# EAGLE design Protoboard MX2-7-6 (EAGLE 7.6.0)
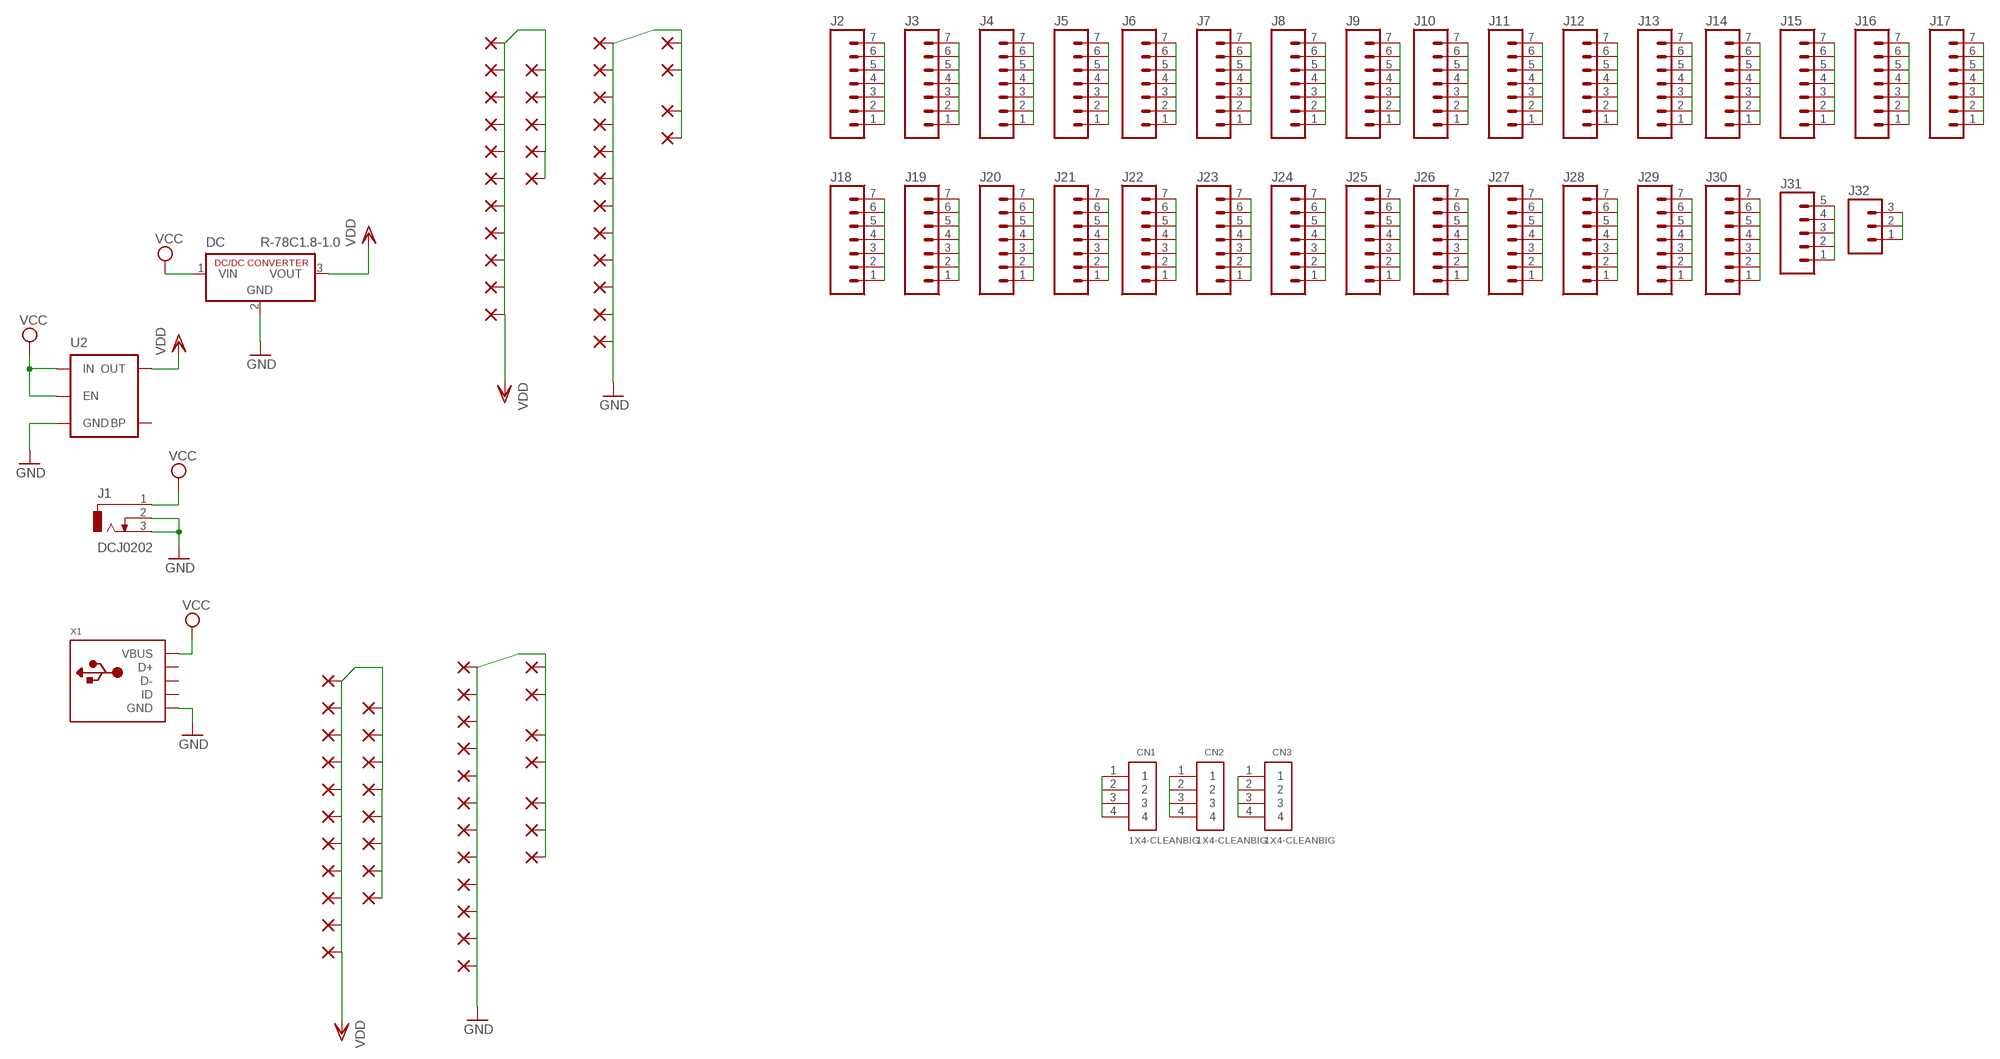
[diagram p0: schematic, sheet 1]

## Parts
CN1  1X4-CLEANBIG  [1X04-CLEANBIG]
CN2  1X4-CLEANBIG  [1X04-CLEANBIG]
CN3  1X4-CLEANBIG  [1X04-CLEANBIG]
DC  R-78C1.8-1.0  [SIP3]
J1  DCJ0202  [DCJ0202]
J2  M07NO_SILK  [1X07_NO_SILK]
J3  M07NO_SILK  [1X07_NO_SILK]
J4  M07NO_SILK  [1X07_NO_SILK]
J5  M07NO_SILK  [1X07_NO_SILK]
J6  M07NO_SILK  [1X07_NO_SILK]
J7  M07NO_SILK  [1X07_NO_SILK]
J8  M07NO_SILK  [1X07_NO_SILK]
J9  M07NO_SILK  [1X07_NO_SILK]
J10  M07NO_SILK  [1X07_NO_SILK]
J11  M07NO_SILK  [1X07_NO_SILK]
J12  M07NO_SILK  [1X07_NO_SILK]
J13  M07NO_SILK  [1X07_NO_SILK]
J14  M07NO_SILK  [1X07_NO_SILK]
J15  M07NO_SILK  [1X07_NO_SILK]
J16  M07NO_SILK  [1X07_NO_SILK]
J17  M07NO_SILK  [1X07_NO_SILK]
J18  M07NO_SILK  [1X07_NO_SILK]
J19  M07NO_SILK  [1X07_NO_SILK]
J20  M07NO_SILK  [1X07_NO_SILK]
J21  M07NO_SILK  [1X07_NO_SILK]
J22  M07NO_SILK  [1X07_NO_SILK]
J23  M07NO_SILK  [1X07_NO_SILK]
J24  M07NO_SILK  [1X07_NO_SILK]
J25  M07NO_SILK  [1X07_NO_SILK]
J26  M07NO_SILK  [1X07_NO_SILK]
J27  M07NO_SILK  [1X07_NO_SILK]
J28  M07NO_SILK  [1X07_NO_SILK]
J29  M07NO_SILK  [1X07_NO_SILK]
J30  M07NO_SILK  [1X07_NO_SILK]
J31  M05NO_SILK  [1X05_NO_SILK]
J32  M031X03_NO_SILK  [1X03_NO_SILK]
PAD4  1,6/0,8  [1,6/0,8]
PAD5  1,6/0,8  [1,6/0,8]
PAD6  1,6/0,8  [1,6/0,8]
PAD7  1,6/0,8  [1,6/0,8]
PAD8  1,6/0,8  [1,6/0,8]
PAD9  1,6/0,8  [1,6/0,8]
PAD10  1,6/0,8  [1,6/0,8]
PAD11  1,6/0,8  [1,6/0,8]
PAD12  1,6/0,8  [1,6/0,8]
PAD13  1,6/0,8  [1,6/0,8]
PAD14  1,6/0,8  [1,6/0,8]
PAD15  1,6/0,8  [1,6/0,8]
PAD16  1,6/0,8  [1,6/0,8]
PAD17  1,6/0,8  [1,6/0,8]
PAD18  1,6/0,8  [1,6/0,8]
PAD19  1,6/0,8  [1,6/0,8]
PAD20  1,6/0,8  [1,6/0,8]
PAD21  1,6/0,8  [1,6/0,8]
PAD22  1,6/0,8  [1,6/0,8]
PAD23  1,6/0,8  [1,6/0,8]
PAD24  1,6/0,8  [1,6/0,8]
PAD25  1,6/0,8  [1,6/0,8]
PAD26  1,6/0,8  [1,6/0,8]
PAD27  1,6/0,8  [1,6/0,8]
PAD28  1,6/0,8  [1,6/0,8]
PAD29  1,6/0,8  [1,6/0,8]
PAD30  1,6/0,8  [1,6/0,8]
PAD31  1,6/0,8  [1,6/0,8]
PAD32  1,6/0,8  [1,6/0,8]
PAD33  1,6/0,8  [1,6/0,8]
PAD36  1,6/0,8  [1,6/0,8]
PAD38  1,6/0,8  [1,6/0,8]
PAD421  1,6/0,8  [1,6/0,8]
PAD422  1,6/0,8  [1,6/0,8]
PAD423  1,6/0,8  [1,6/0,8]
PAD424  1,6/0,8  [1,6/0,8]
PAD425  1,6/0,8  [1,6/0,8]
PAD426  1,6/0,8  [1,6/0,8]
PAD427  1,6/0,8  [1,6/0,8]
PAD428  1,6/0,8  [1,6/0,8]
PAD429  1,6/0,8  [1,6/0,8]
PAD430  1,6/0,8  [1,6/0,8]
PAD431  1,6/0,8  [1,6/0,8]
PAD432  1,6/0,8  [1,6/0,8]
PAD433  1,6/0,8  [1,6/0,8]
PAD434  1,6/0,8  [1,6/0,8]
PAD435  1,6/0,8  [1,6/0,8]
PAD436  1,6/0,8  [1,6/0,8]
PAD439  1,6/0,8  [1,6/0,8]
PAD440  1,6/0,8  [1,6/0,8]
PAD441  1,6/0,8  [1,6/0,8]
PAD442  1,6/0,8  [1,6/0,8]
PAD443  1,6/0,8  [1,6/0,8]
PAD444  1,6/0,8  [1,6/0,8]
PAD445  1,6/0,8  [1,6/0,8]
PAD446  1,6/0,8  [1,6/0,8]
PAD447  1,6/0,8  [1,6/0,8]
PAD448  1,6/0,8  [1,6/0,8]
PAD449  1,6/0,8  [1,6/0,8]
PAD450  1,6/0,8  [1,6/0,8]
PAD451  1,6/0,8  [1,6/0,8]
PAD452  1,6/0,8  [1,6/0,8]
PAD453  1,6/0,8  [1,6/0,8]
PAD454  1,6/0,8  [1,6/0,8]
PAD455  1,6/0,8  [1,6/0,8]
PAD456  1,6/0,8  [1,6/0,8]
PAD459  1,6/0,8  [1,6/0,8]
PAD460  1,6/0,8  [1,6/0,8]
PAD461  1,6/0,8  [1,6/0,8]
PAD462  1,6/0,8  [1,6/0,8]
U2  MIC52053.3V  [SOT23-5]
X1  USBMICRO_20329  [4UCONN_20329]

## Nets
GND: DC.2(GND) J1.2 J1.3 PAD4.1(P) PAD17.1(P) PAD22.1(P) PAD23.1(P) PAD24.1(P) PAD25.1(P) PAD26.1(P) PAD27.1(P) PAD28.1(P) PAD29.1(P) PAD30.1(P) PAD31.1(P) PAD32.1(P) PAD33.1(P) PAD36.1(P) PAD38.1(P) PAD421.1(P) PAD422.1(P) PAD423.1(P) PAD424.1(P) PAD425.1(P) PAD426.1(P) PAD427.1(P) PAD428.1(P) PAD429.1(P) PAD430.1(P) PAD431.1(P) PAD432.1(P) PAD433.1(P) PAD434.1(P) PAD435.1(P) PAD436.1(P) PAD439.1(P) PAD440.1(P) PAD441.1(P) U2.2(GND) X1.BASE@1(GND) X1.BASE@2(GND) X1.GND X1.SPRT@1(GND) X1.SPRT@2(GND) X1.SPRT@3(GND) X1.SPRT@4(GND)
N$1: J2.1 J2.2 J2.3 J2.4 J2.5 J2.6 J2.7
N$2: CN1.1 CN1.2 CN1.3 CN1.4
N$3: CN2.1 CN2.2 CN2.3 CN2.4
N$4: CN3.1 CN3.2 CN3.3 CN3.4
N$5: J3.1 J3.2 J3.3 J3.4 J3.5 J3.6 J3.7
N$6: J4.1 J4.2 J4.3 J4.4 J4.5 J4.6 J4.7
N$7: J5.1 J5.2 J5.3 J5.4 J5.5 J5.6 J5.7
N$8: J6.1 J6.2 J6.3 J6.4 J6.5 J6.6 J6.7
N$9: J7.1 J7.2 J7.3 J7.4 J7.5 J7.6 J7.7
N$10: J8.1 J8.2 J8.3 J8.4 J8.5 J8.6 J8.7
N$11: J9.1 J9.2 J9.3 J9.4 J9.5 J9.6 J9.7
N$12: J10.1 J10.2 J10.3 J10.4 J10.5 J10.6 J10.7
N$13: J11.1 J11.2 J11.3 J11.4 J11.5 J11.6 J11.7
N$14: J12.1 J12.2 J12.3 J12.4 J12.5 J12.6 J12.7
N$15: J13.1 J13.2 J13.3 J13.4 J13.5 J13.6 J13.7
N$16: J14.1 J14.2 J14.3 J14.4 J14.5 J14.6 J14.7
N$17: J15.1 J15.2 J15.3 J15.4 J15.5 J15.6 J15.7
N$18: J16.1 J16.2 J16.3 J16.4 J16.5 J16.6 J16.7
N$19: J17.1 J17.2 J17.3 J17.4 J17.5 J17.6 J17.7
N$20: J18.1 J18.2 J18.3 J18.4 J18.5 J18.6 J18.7
N$21: J19.1 J19.2 J19.3 J19.4 J19.5 J19.6 J19.7
N$22: J20.1 J20.2 J20.3 J20.4 J20.5 J20.6 J20.7
N$27: J21.1 J21.2 J21.3 J21.4 J21.5 J21.6 J21.7
N$28: J22.1 J22.2 J22.3 J22.4 J22.5 J22.6 J22.7
N$29: J23.1 J23.2 J23.3 J23.4 J23.5 J23.6 J23.7
N$30: J24.1 J24.2 J24.3 J24.4 J24.5 J24.6 J24.7
N$31: J25.1 J25.2 J25.3 J25.4 J25.5 J25.6 J25.7
N$32: J26.1 J26.2 J26.3 J26.4 J26.5 J26.6 J26.7
N$33: J27.1 J27.2 J27.3 J27.4 J27.5 J27.6 J27.7
N$35: J28.1 J28.2 J28.3 J28.4 J28.5 J28.6 J28.7
N$36: J29.1 J29.2 J29.3 J29.4 J29.5 J29.6 J29.7
N$37: J30.1 J30.2 J30.3 J30.4 J30.5 J30.6 J30.7
N$38: J31.1 J31.2 J31.3 J31.4 J31.5
N$39: J32.1 J32.2 J32.3
VCC: DC.1(VIN) J1.1 U2.1(IN) U2.3(EN) X1.VBUS
VDD: DC.3(VOUT) PAD5.1(P) PAD6.1(P) PAD7.1(P) PAD8.1(P) PAD9.1(P) PAD10.1(P) PAD11.1(P) PAD12.1(P) PAD13.1(P) PAD14.1(P) PAD15.1(P) PAD16.1(P) PAD18.1(P) PAD19.1(P) PAD20.1(P) PAD21.1(P) PAD442.1(P) PAD443.1(P) PAD444.1(P) PAD445.1(P) PAD446.1(P) PAD447.1(P) PAD448.1(P) PAD449.1(P) PAD450.1(P) PAD451.1(P) PAD452.1(P) PAD453.1(P) PAD454.1(P) PAD455.1(P) PAD456.1(P) PAD459.1(P) PAD460.1(P) PAD461.1(P) PAD462.1(P) U2.5(OUT)
Unconnected: U2.4(BP) X1.D+ X1.D- X1.ID

## Library data of the parts
CN1-CN3 = adafruit:1X4: 4-pin connector
DC = dc-dc-converter:R-78C*-1.0: INNOLINE DC/DC-Converter 1.0 AMP SIP3 Single Output Source: Data sheet <http://www.mikrocontroller.net/attachment/150645/157764-da-01-en-DC_DC_WANDLER_R_78C5_0_1_0.pdf>
J1 = con-jack:DCJ0202: DC POWER JACK Source: DCJ0202.pdf; OC_FARNELL: unknown; OC_NEWARK: unknown
J2-J30 = SparkFun-Connectors:M07: Header 7 Standard 7-pin 0.1" header. Use with straight break away headers (SKU : PRT-00116), right angle break away headers (PRT-00553), swiss pins (PRT-00743), machine pins (PRT-00117), and female headers (PRT-00115). NOTES ON THE VARIANTS LOCK and LOCK_LONGPADS... This footprint was designed to help hold the alignment of a through-hole component (i.e. 7-pin header) while soldering it into place. You may notice that each hole has been shifted either up or down by 0.005 of an inch from it's more standard position (which is usually a perfectly straight line). This slight alteration caused the pins (the squares in the middle) to touch the edges of the holes. Because they are alternating, it causes a "brace" to hold the header in place. 0.005 has proven to be the perfect amount of "off-center" position when using our standard breakaway headers. Although looks a little odd when you look at the bare footprint, once you have a header in there, the alteration is very hard to notice. Also, if you push a header all the way into place, it is covered up entirely on the bottom side. This idea of altering the position of holes to aid alignment will be further integrated into the Sparkfun Library for other footprints. It can help hold any component with 3 or more connection pins.
J31 = SparkFun-Connectors:M05: Header 5 Standard 5-pin 0.1" header. Use with straight break away headers (SKU : PRT-00116), right angle break away headers (PRT-00553), swiss pins (PRT-00743), machine pins (PRT-00117), and female headers (PRT-00115). Molex polarized connector foot print use with SKU : PRT-08230 with associated crimp pins and housings.
J32 = SparkFun-Connectors:M03: Header 3 Standard 3-pin 0.1" header. Use with straight break away headers (SKU : PRT-00116), right angle break away headers (PRT-00553), swiss pins (PRT-00743), machine pins (PRT-00117), and female headers (PRT-00115). Molex polarized connector foot print use with SKU : PRT-08232 with associated crimp pins and housings.
PAD4-PAD33 PAD36 PAD38 PAD421-PAD436 PAD439-PAD456 PAD459-PAD462 = wirepad:1,6/0,8: THROUGH-HOLE PAD
U2 = SparkFun-PowerIC:MIC5205: MIC5205 150mA vreg 3.3V - VREG-00822 5V - VREG-00823; PROD_ID: VREG-00822
X1 = microbuilder:USB: USB Connectors USBMINIB - Surface Mount Female Mini-B USB Connector 4UConnector: 06564

## Net classes
0 default: width 0.508 mm, drill 0.508 mm, clearance 0.127 mm

## Board
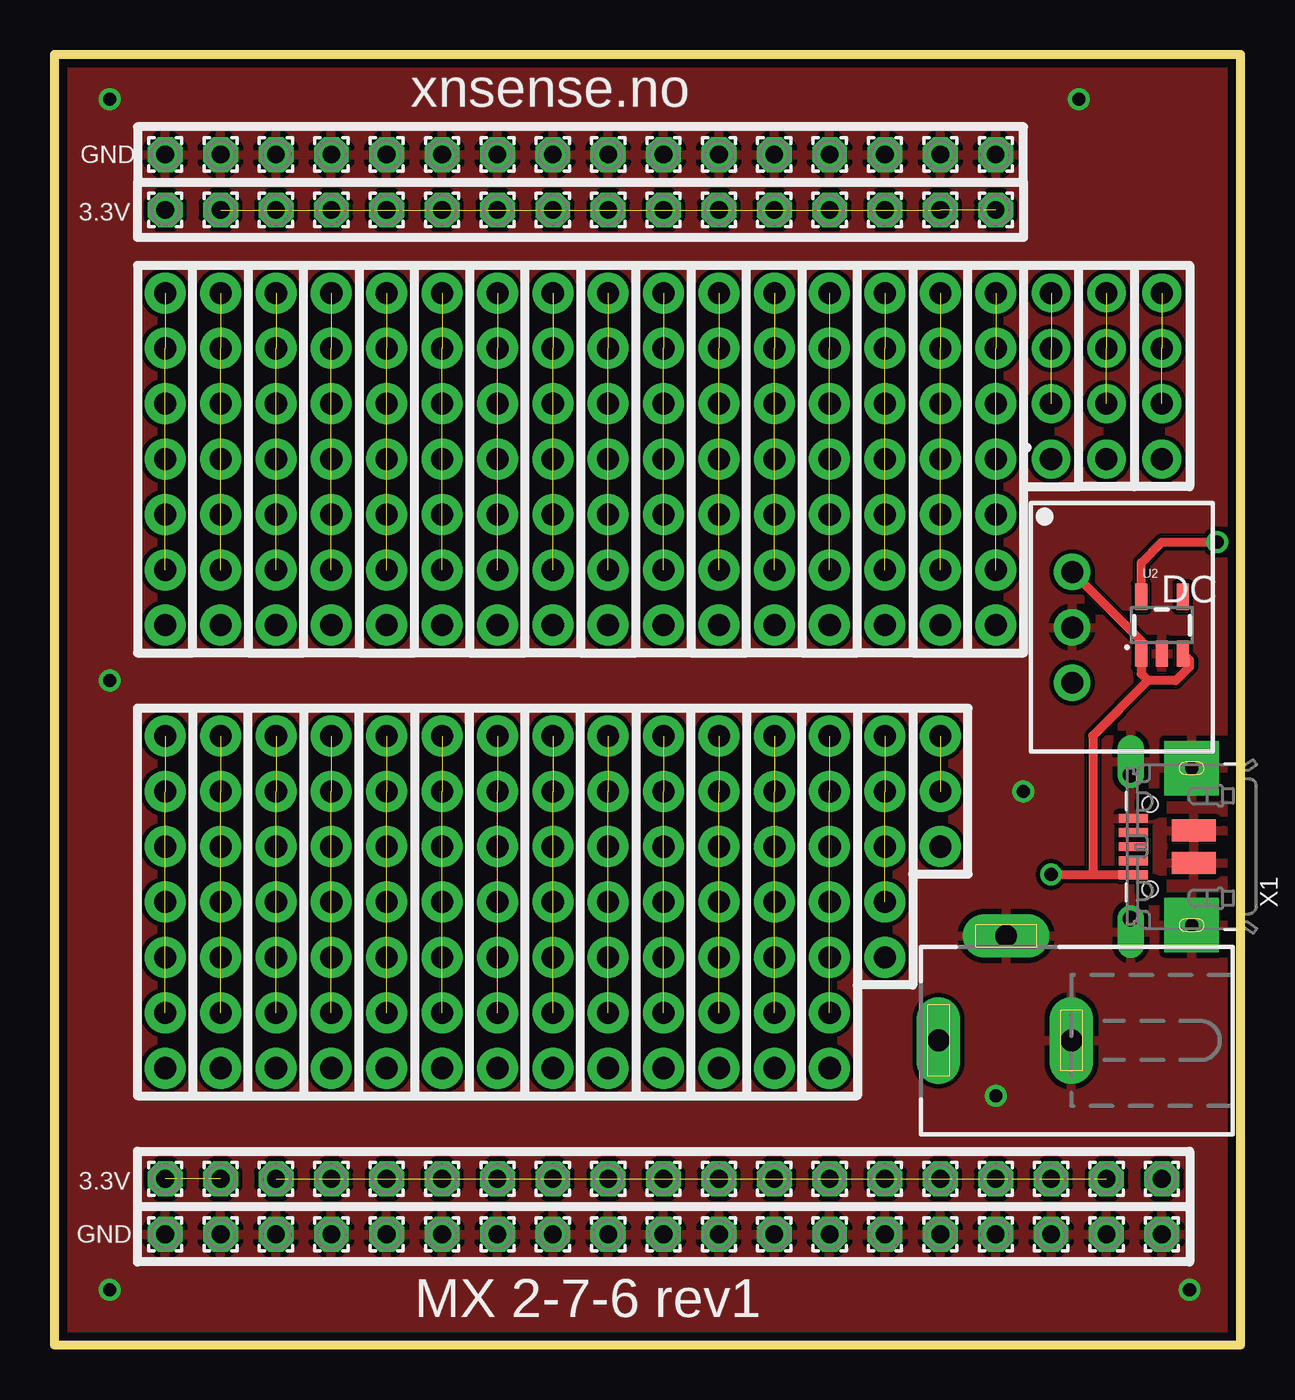
[diagram p1: board, top side]
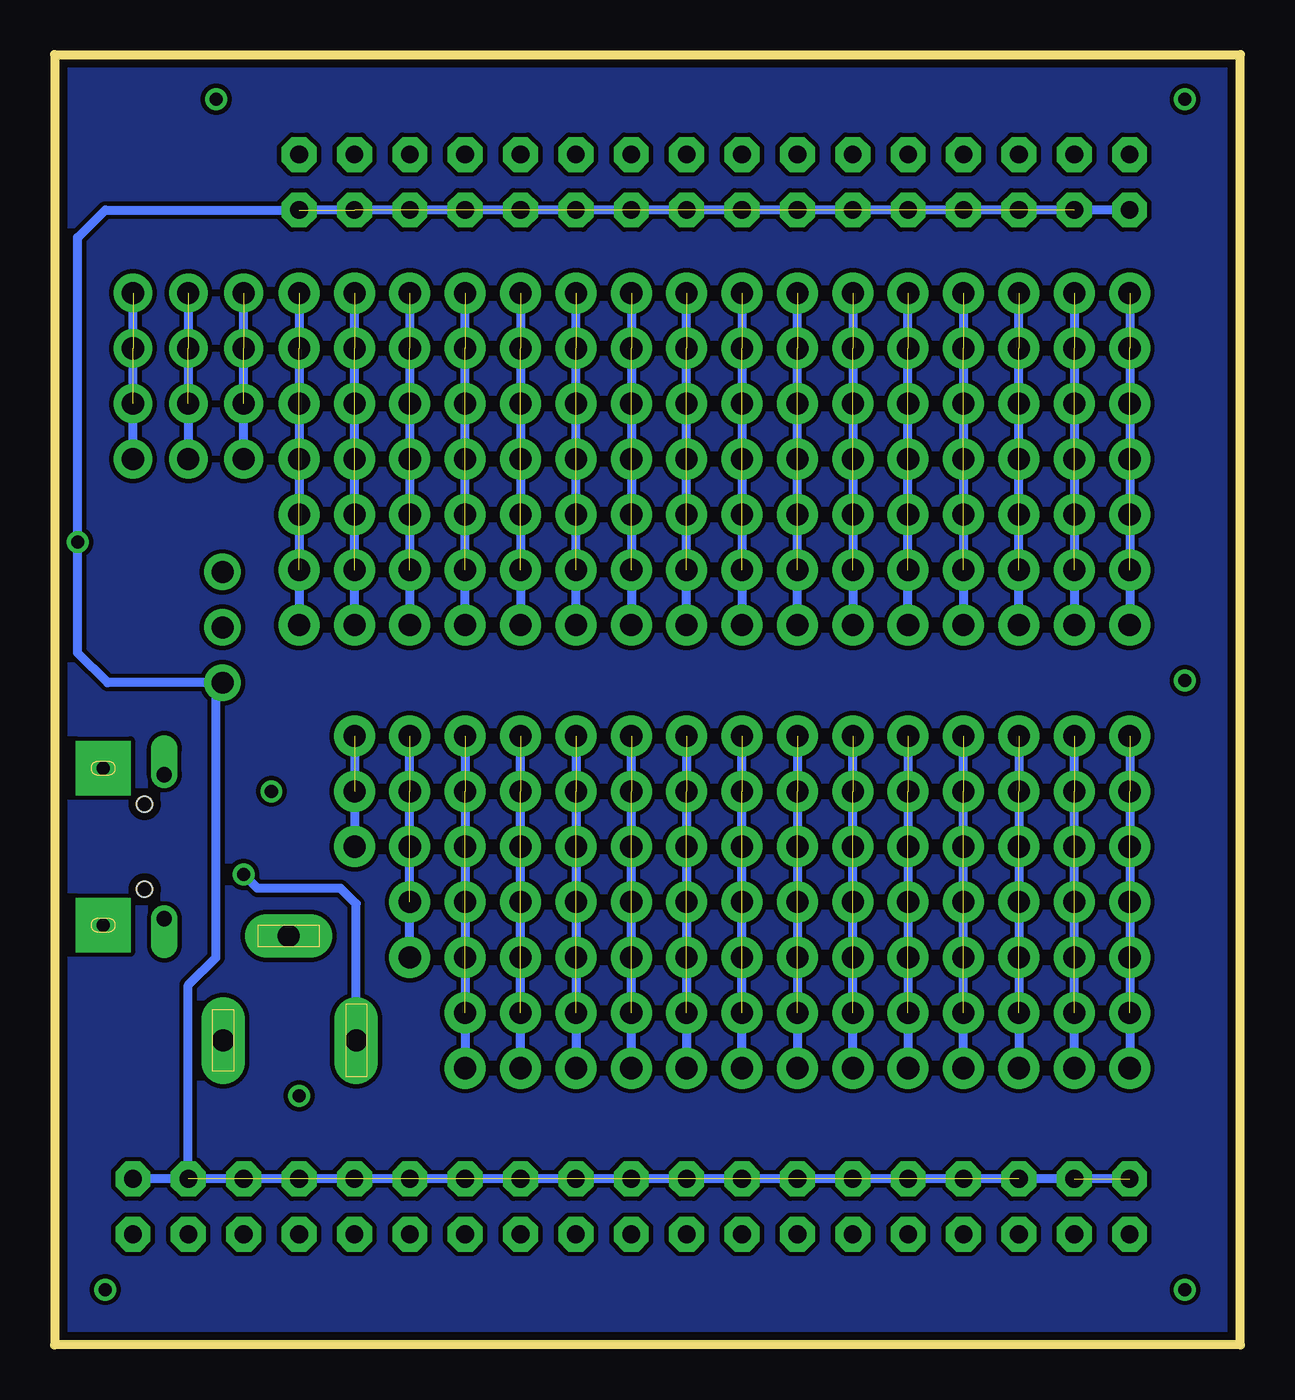
[diagram p2: board, bottom side, seen from below]

Size 54.4 x 59.2 mm. Coordinates in mm from the lower left corner, seen from the top.
Outline: 0,0 0,59.2 54.4,59.2 54.4,0 0,0
Copper layers (1*16): Top 0.035mm / dielectric 1.5mm / Bottom 0.035mm
Design rules "default *": minimum track width 10mil, minimum drill 20mil, track to track 8mil, track to pad 8mil, pad to pad 8mil, via to via 8mil, smd to smd 8mil, copper to edge 15mil, drill to drill 8mil, minimum pad ring 10mil, minimum via ring 8mil, stop-mask expansion 4mil, vias tented up to drill 0mil, thermal gap 10mil

### Footprints (pad centres in the part's own frame; a part is rotated, then mirrored left to right if it is on the bottom)
1X04-CLEANBIG = drill 1.016 pad 1.778: 1 -3.81,0; 2 -1.27,0; 3 1.27,0; 4 3.81,0
SIP3 = drill 1 pad 1.676: 1 -2.54,0; 2 0,0; 3 2.54,0
DCJ0202 = drill 1 pad 2 long: 1 0,3.1; 2 4.8,0; 3 0,-3
1X07_NO_SILK = drill 1.016 pad 1.88: 1 0,0; 2 2.54,0; 3 5.08,0; 4 7.62,0; 5 10.16,0; 6 12.7,0; 7 15.24,0
1X05_NO_SILK = drill 1.016 pad 1.88: 1 0,0; 2 2.54,0; 3 5.08,0; 4 7.62,0; 5 10.16,0
1X03_NO_SILK = drill 1.016 pad 1.88: 1 0,0; 2 2.54,0; 3 5.08,0
1,6/0,8 = drill 0.813 pad 1.6 octagon: 1 0,0
SOT23-5 = smd 0.55 x 1.2: 1 -0.95,-1.3; 2 0,-1.3; 3 0.95,-1.3; 4 0.95,1.3; 5 -0.95,1.3
4UCONN_20329 = smd 1 x 2: BASE@1 -0.75,-2; BASE@2 0.75,-2 | smd 0.4 x 1.35: D+ 0,0.775; D- -0.65,0.775; GND 1.3,0.775; ID 0.65,0.775; VBUS -1.3,0.775 | drill 0.7 offset: SPRT@1 -3.3,0.9; SPRT@2 3.3,0.9 | drill 0.6 pad 2.5 square: SPRT@3 -3.6,-1.9; SPRT@4 3.6,-1.9 | hole 0.7: -1.95,0; 1.95,0

### Placement (x,y rotation side)
CN1  45.72,44.45 90 top
CN2  48.26,44.45 90 top
CN3  50.8,44.45 90 top
DC  46.69,32.92 270 top
J1  43.66,13.97 90 top
J2  5.08,33.02 90 top
J3  7.62,33.02 90 top
J4  10.16,33.02 90 top
J5  12.7,33.02 90 top
J6  15.24,33.02 90 top
J7  17.78,33.02 90 top
J8  20.32,33.02 90 top
J9  22.86,33.02 90 top
J10  25.4,33.02 90 top
J11  27.94,33.02 90 top
J12  30.48,33.02 90 top
J13  33.02,33.02 90 top
J14  35.56,33.02 90 top
J15  38.1,33.02 90 top
J16  40.64,33.02 90 top
J17  43.18,33.02 90 top
J18  5.08,12.7 90 top
J19  7.62,12.7 90 top
J20  10.16,12.7 90 top
J21  12.7,12.7 90 top
J22  15.24,12.7 90 top
J23  17.78,12.7 90 top
J24  20.32,12.7 90 top
J25  22.86,12.7 90 top
J26  25.4,12.7 90 top
J27  27.94,12.7 90 top
J28  30.48,12.7 90 top
J29  33.02,12.7 90 top
J30  35.56,12.7 90 top
J31  38.1,17.78 90 top
J32  40.64,22.86 90 top
PAD4  20.32,54.61 0 top
PAD5  40.64,52.07 0 top
PAD6  17.78,52.07 0 top
PAD7  20.32,52.07 0 top
PAD8  22.86,52.07 0 top
PAD9  38.1,52.07 0 top
PAD10  5.08,52.07 0 top
PAD11  15.24,52.07 0 top
PAD12  35.56,52.07 0 top
PAD13  10.16,52.07 0 top
PAD14  7.62,52.07 0 top
PAD15  33.02,52.07 0 top
PAD16  43.18,52.07 0 top
PAD17  5.08,54.61 0 top
PAD18  30.48,52.07 0 top
PAD19  25.4,52.07 0 top
PAD20  12.7,52.07 0 top
PAD21  27.94,52.07 0 top
PAD22  30.48,54.61 0 top
PAD23  40.64,54.61 0 top
PAD24  7.62,54.61 0 top
PAD25  27.94,54.61 0 top
PAD26  43.18,54.61 0 top
PAD27  10.16,54.61 0 top
PAD28  25.4,54.61 0 top
PAD29  38.1,54.61 0 top
PAD30  12.7,54.61 0 top
PAD31  22.86,54.61 0 top
PAD32  35.56,54.61 0 top
PAD33  15.24,54.61 0 top
PAD36  17.78,54.61 0 top
PAD38  33.02,54.61 0 top
PAD421  5.08,5.08 0 top
PAD422  25.4,5.08 0 top
PAD423  12.7,5.08 0 top
PAD424  7.62,5.08 0 top
PAD425  43.18,5.08 0 top
PAD426  15.24,5.08 0 top
PAD427  10.16,5.08 0 top
PAD428  50.8,5.08 0 top
PAD429  17.78,5.08 0 top
PAD430  38.1,5.08 0 top
PAD431  48.26,5.08 0 top
PAD432  20.32,5.08 0 top
PAD433  40.64,5.08 0 top
PAD434  45.72,5.08 0 top
PAD435  22.86,5.08 0 top
PAD436  35.56,5.08 0 top
PAD439  33.02,5.08 0 top
PAD440  30.48,5.08 0 top
PAD441  27.94,5.08 0 top
PAD442  27.94,7.62 0 top
PAD443  40.64,7.62 0 top
PAD444  5.08,7.62 0 top
PAD445  43.18,7.62 0 top
PAD446  38.1,7.62 0 top
PAD447  7.62,7.62 0 top
PAD448  50.8,7.62 0 top
PAD449  35.56,7.62 0 top
PAD450  10.16,7.62 0 top
PAD451  48.26,7.62 0 top
PAD452  33.02,7.62 0 top
PAD453  12.7,7.62 0 top
PAD454  45.72,7.62 0 top
PAD455  30.48,7.62 0 top
PAD456  15.24,7.62 0 top
PAD459  17.78,7.62 0 top
PAD460  25.4,7.62 0 top
PAD461  22.86,7.62 0 top
PAD462  20.32,7.62 0 top
U2  50.8,33.02 0 top
X1  50.27,22.86 90 top

### Tracks (layer width: path | path; a pad name or v marks a point on that pad's centre or on a via)
GND  (via drill 0.6)
  other vias: 2.54,57.15 46.99,57.15 2.54,30.48 2.54,2.54 52.07,2.54 43.18,11.43 44.45,25.4
  pour Top: 0,59.2 0,0 54.4,0 54.4,59.2
N$1  (5 unrouted)
  Bottom 0.406: J2.7 J2.1
N$2  (2 unrouted)
  Bottom 0.406: CN1.1 CN1.4
N$3  (2 unrouted)
  Bottom 0.406: CN2.4 CN2.1
N$4  (2 unrouted)
  Bottom 0.406: CN3.1 CN3.4
N$5  (5 unrouted)
  Bottom 0.406: J3.7 J3.1
N$6  (5 unrouted)
  Bottom 0.406: J4.1 J4.7
N$7  (5 unrouted)
  Bottom 0.406: J5.7 J5.1
N$8  (5 unrouted)
  Bottom 0.406: J6.1 J6.7
N$9  (5 unrouted)
  Bottom 0.406: J7.7 J7.1
N$10  (5 unrouted)
  Bottom 0.406: J8.1 J8.7
N$11  (5 unrouted)
  Bottom 0.406: J9.7 J9.1
N$12  (5 unrouted)
  Bottom 0.406: J10.1 J10.7
N$13  (5 unrouted)
  Bottom 0.406: J11.7 J11.1
N$14  (5 unrouted)
  Bottom 0.406: J12.1 J12.7
N$15  (5 unrouted)
  Bottom 0.406: J13.7 J13.1
N$16  (5 unrouted)
  Bottom 0.406: J14.1 J14.7
N$17  (5 unrouted)
  Bottom 0.406: J15.7 J15.1
N$18  (5 unrouted)
  Bottom 0.406: J16.1 J16.7
N$19  (5 unrouted)
  Bottom 0.406: J17.7 J17.1
N$20  (5 unrouted)
  Bottom 0.406: J18.7 J18.1
N$21  (5 unrouted)
  Bottom 0.406: J19.1 J19.7
N$22  (5 unrouted)
  Bottom 0.406: J20.7 J20.1
N$27  (5 unrouted)
  Bottom 0.406: J21.1 J21.7
N$28  (5 unrouted)
  Bottom 0.406: J22.7 J22.1
N$29  (5 unrouted)
  Bottom 0.406: J23.1 J23.7
N$30  (5 unrouted)
  Bottom 0.406: J24.7 J24.1
N$31  (5 unrouted)
  Bottom 0.406: J25.1 J25.7
N$32  (5 unrouted)
  Bottom 0.406: J26.7 J26.1
N$33  (5 unrouted)
  Bottom 0.406: J27.1 J27.7
N$35  (5 unrouted)
  Bottom 0.406: J28.7 J28.1
N$36  (5 unrouted)
  Bottom 0.406: J29.1 J29.7
N$37  (5 unrouted)
  Bottom 0.406: J30.7 J30.1
N$38  (3 unrouted)
  Bottom 0.406: J31.1 J31.5
N$39  (1 unrouted)
  Bottom 0.406: J32.3 J32.1
N$45
  pour Bottom: 0,59.2 54.4,59.2 54.4,0 0,0
VCC  (via drill 0.6)
  Top 0.406: v45.72,21.59 47.62,21.59 | 47.62,21.59 49.46,21.59 X1.VBUS | DC.1 49.85,32.3 U2.1 49.85,30.8 50.16,30.48 | U2.3 52.07,31.4 52.07,31.11 51.44,30.48 50.16,30.48 | 50.16,30.48 47.62,27.94 47.62,21.59
  Bottom 0.406: J1.1 40.56,20.24 41.27,20.95 45.09,20.95 v45.72,21.59
VDD  (via drill 0.6)  (30 unrouted)
  Top 0.406: U2.5 49.85,35.88 50.8,36.83 v53.34,36.83
  Bottom 0.406: PAD10.1 PAD16.1 52.07,52.07 53.34,50.8 v53.34,36.83 53.34,31.75 51.97,30.38 DC.3 46.99,30.08 46.99,17.78 48.26,16.51 PAD451.1 | PAD444.1 PAD451.1 | PAD451.1 PAD448.1

### Text on the board
tNames: xnsense.no | GND | 3.3V | 3.3V | GND | MX 2-7-6 rev1